# EAGLE schematic cm5_redraw (EAGLE 9.6.0)
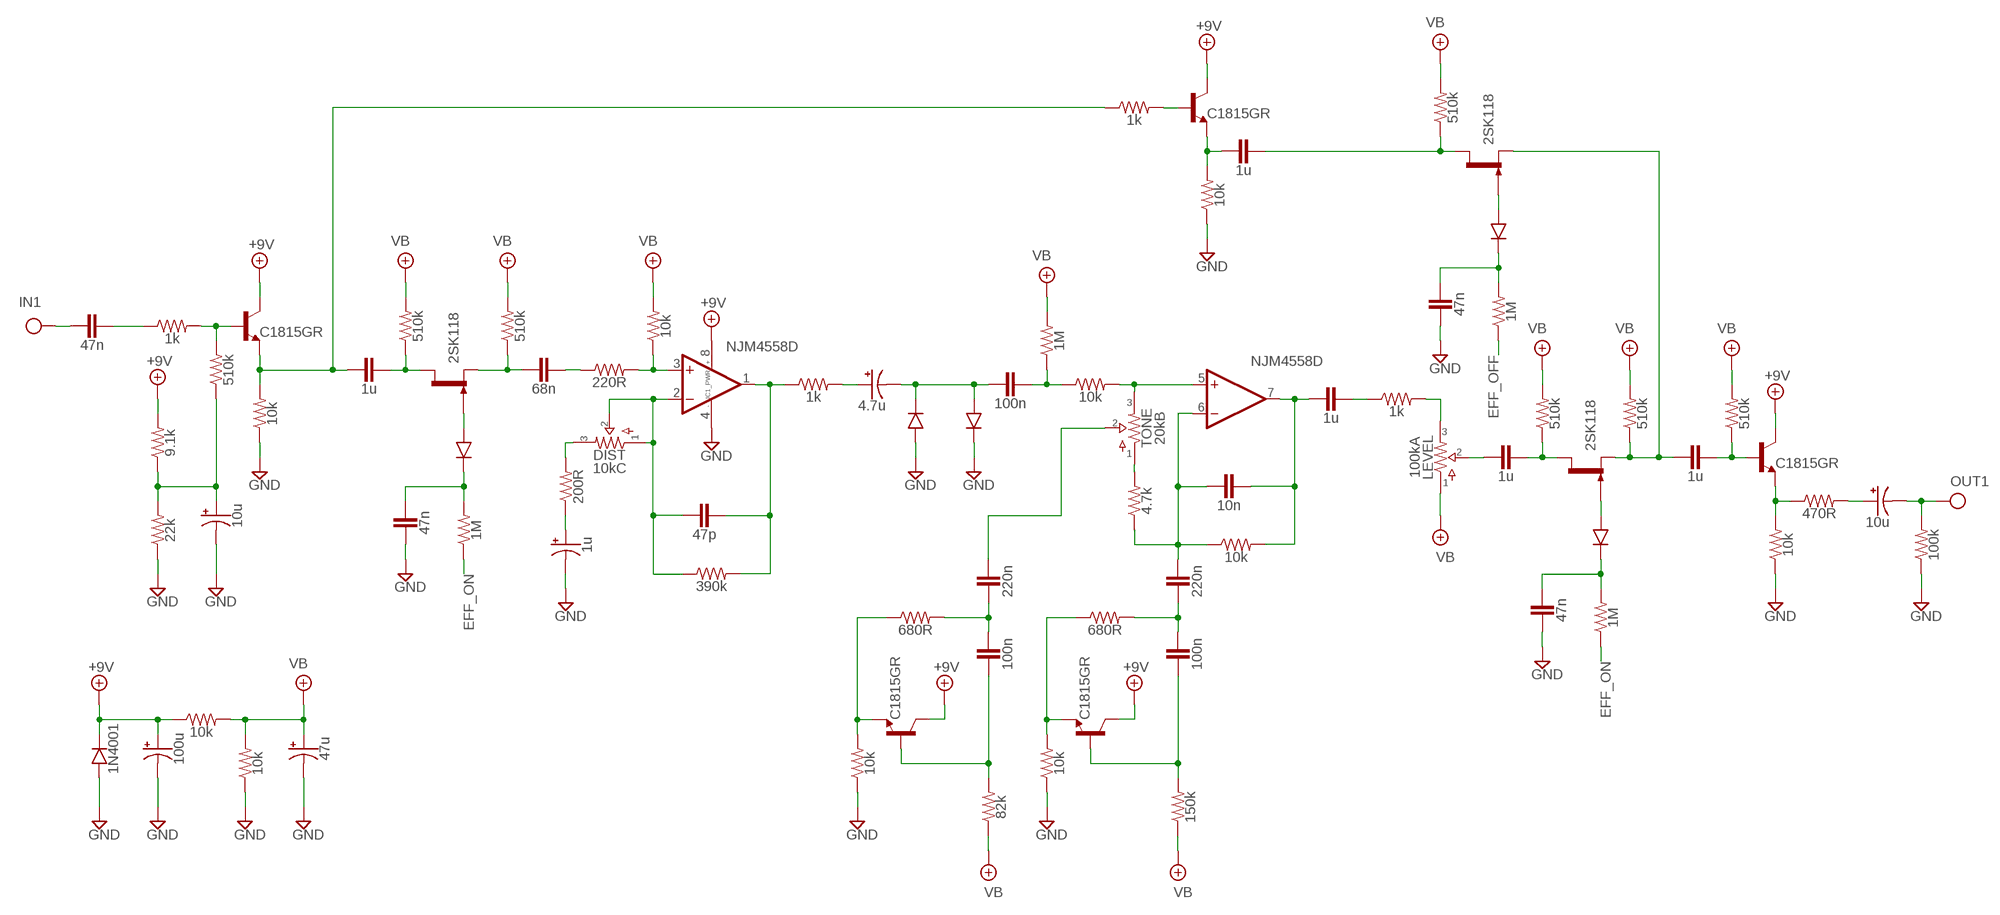
[diagram p0: schematic, sheet 1]

## Parts
C1  47n  CER/FILM1  [050X030_025]
C2  10u  0500  [050_020]
C3  1u  CER/FILM1  [050X030_025]
C4  68n  CER/FILM1  [050X030_025]
C5  47p  CER/FILM1  [050X030_025]
C6  1u  0500  [050_020]
C7  4.7u  0500  [050_020]
C8  100n  CER/FILM1  [050X030_025]
C9  220n  CER/FILM1  [050X030_025]
C10  100n  CER/FILM1  [050X030_025]
C11  220n  CER/FILM1  [050X030_025]
C12  100n  CER/FILM1  [050X030_025]
C15  10n  CER/FILM1  [050X030_025]
C16  1u  CER/FILM1  [050X030_025]
C17  1u  CER/FILM1  [050X030_025]
C18  1u  CER/FILM1  [050X030_025]
C19  10u  0500  [050_020]
C20  1u  CER/FILM1  [050X030_025]
C21  47n  CER/FILM1  [050X030_025]
C25  47n  CER/FILM1  [050X030_025]
C26  47n  CER/FILM1  [050X030_025]
C27  100u  0500  [050_020]
C28  47u  0500  [050_020]
D1  1N4148  DO41.2  [DO41-2]
D2  1N4148  DO41.2  [DO41-2]
D3  1N4148  DO41.2  [DO41-2]
D4  1N4148  DO41.2  [DO41-2]
D5  1N4148  DO41.2  [DO41-2]
D6  1N4001  DO41.2  [DO41-2]
DIST  10kC  POTS16MM  [16MM]
IC1  NJM4558D  DUALTH  [DIL0]
LEVEL  100kA  POTS16MM  [16MM]
Q1  2SK118  2SK170  [TO92-]
Q2  2SK118  2SK170  [TO92-]
Q3  2SK118  2SK170  [TO92-]
R1  1k  R_.3B  [R0207/3]
R2  510k  R_.3B  [R0207/3]
R3  9.1k  R_.3B  [R0207/3]
R4  22k  R_.3B  [R0207/3]
R5  10k  R_.3B  [R0207/3]
R6  510k  R_.3B  [R0207/3]
R7  510k  R_.3B  [R0207/3]
R8  220R  R_.3B  [R0207/3]
R9  10k  R_.3B  [R0207/3]
R10  390k  R_.3B  [R0207/3]
R11  200R  R_.3B  [R0207/3]
R12  1k  R_.3B  [R0207/3]
R13  1M  R_.3B  [R0207/3]
R14  10k  R_.3B  [R0207/3]
R15  680R  R_.3B  [R0207/3]
R16  10k  R_.3B  [R0207/3]
R17  82k  R_.3B  [R0207/3]
R18  4.7k  R_.3B  [R0207/3]
R19  680R  R_.3B  [R0207/3]
R20  10k  R_.3B  [R0207/3]
R21  150k  R_.3B  [R0207/3]
R25  10k  R_.3B  [R0207/3]
R26  1k  R_.3B  [R0207/3]
R27  510k  R_.3B  [R0207/3]
R28  510k  R_.3B  [R0207/3]
R29  10k  R_.3B  [R0207/3]
R30  470R  R_.3B  [R0207/3]
R31  100k  R_.3B  [R0207/3]
R32  1k  R_.3B  [R0207/3]
R33  10k  R_.3B  [R0207/3]
R34  510k  R_.3B  [R0207/3]
R35  510k  R_.3B  [R0207/3]
R36  1M  R_.3B  [R0207/3]
R40  10k  R_.3B  [R0207/3]
R44  1M  R_.3B  [R0207/3]
R45  1M  R_.3B  [R0207/3]
R49  10k  R_.3B  [R0207/3]
TONE  20kB  POTS16MM  [16MM]
TR1  C1815GR  2N3904  [TO92-]
TR2  C1815GR  2N3904  [TO92-]
TR3  C1815GR  2N3904  [TO92-]
TR5  C1815GR  2N3904  [TO92-]
TR6  C1815GR  2N3904  [TO92-]

## Nets
+9V: C27.+ D6.C IC1.8(_PWR:V+) R3.2 R40.1 TR1.1(C) TR2.1(C) TR3.1(C) TR5.1(C) TR6.1(C)
EFF_OFF: R36.1
EFF_ON: R44.1
GND: C2.- C6.- C21.2 C25.2 C26.2 C27.- C28.- D2.C D3.A D6.A IC1.4(_PWR:V-) R4.1 R5.1 R16.1 R20.1 R29.1 R31.1 R33.1 R49.1
IN: C1.2
N$2: C1.1 R1.1
N$3: R1.2 R2.2 TR1.2(B)
N$4: C3.2 R5.2 R32.1 TR1.3(E)
N$5: C25.1 D1.C R44.2
N$6: C2.+ R2.1 R3.1 R4.2
N$7: C3.1 Q1.3(D) R6.1
N$8: C4.2 Q1.1(S) R7.1
N$9: D1.A Q1.2(G)
N$10: IC1.3(_A:+IN) R8.2 R9.1
N$11: C4.1 R8.1
N$12: C7.+ R12.2
N$13: C5.1 IC1.1(_A:OUT) R10.2 R12.1
N$14: C6.+ R11.1
N$15: DIST.3 R11.2
N$16: C5.2 DIST.1 DIST.2 IC1.2(_A:-IN) R10.1
N$17: C7.- C8.2 D2.A D3.C
N$18: C8.1 R13.1 R14.1
N$19: C11.1 C15.2 IC1.6(_B:-IN) R18.1 R25.1
N$20: C15.1 C16.2 IC1.7(_B:OUT) R25.2
N$21: IC1.5(_B:+IN) R14.2 TONE.3
N$22: R18.2 TONE.1
N$23: C11.2 C12.1 R19.2
N$24: R19.1 R20.2 TR3.3(E)
N$25: C12.2 R21.2 TR3.2(B)
N$26: C9.2 C10.1 R15.2
N$27: R15.1 R16.2 TR2.3(E)
N$28: C10.2 R17.2 TR2.2(B)
N$29: C9.1 TONE.2
N$30: C16.1 R26.1
N$31: LEVEL.3 R26.2
N$32: C17.2 LEVEL.2
N$33: C21.1 D5.C R36.2
N$34: D5.A Q3.2(G)
N$35: R32.2 TR6.2(B)
N$36: C20.2 R33.2 TR6.3(E)
N$37: C20.1 Q3.3(D) R34.1
N$38: C18.2 Q2.1(S) Q3.1(S) R35.1
N$41: C17.1 Q2.3(D) R27.1
N$42: C18.1 R28.1 TR5.2(B)
N$43: R29.2 R30.1 TR5.3(E)
N$44: C19.+ R30.2
N$46: C26.1 D4.C R45.2
N$47: D4.A Q2.2(G)
N$48: R45.1
OUT: C19.- R31.2
VB: C28.+ LEVEL.1 R6.2 R7.2 R9.2 R13.2 R17.1 R21.1 R27.2 R28.2 R34.2 R35.2 R40.2 R49.2

## Library data of the parts
C1 C3-C5 C8-C12 C15-C18 C20 C21 C25 C26 = pedals-capacitors-film:CER/FILM: 47 - 120pF Xicon Ceramic Disc 2.5mm lead spacing
C2 C6 C7 C19 C27 C28 = pedals-capacitors-elec:050
D1-D6 = pedals-diodes:DO41: DO-41 Package Diodes: 1N4001 - 1N40019 Zener Diodes: 1N4728 - 1N4764
DIST LEVEL TONE = pedals-potentiometers:POTS
IC1 = pedals-integrated circuits:DUAL: OP AMP
Q1-Q3 = pedals-transistors:2SK170
R1-R21 R25-R36 R40 R44 R45 R49 = pedals-resistors:R_
TR1-TR3 TR5 TR6 = pedals-transistors:2N3904: NPN Transistor